# EAGLE board 8iPanelLED (EAGLE 6.6.0), part 1 of 2
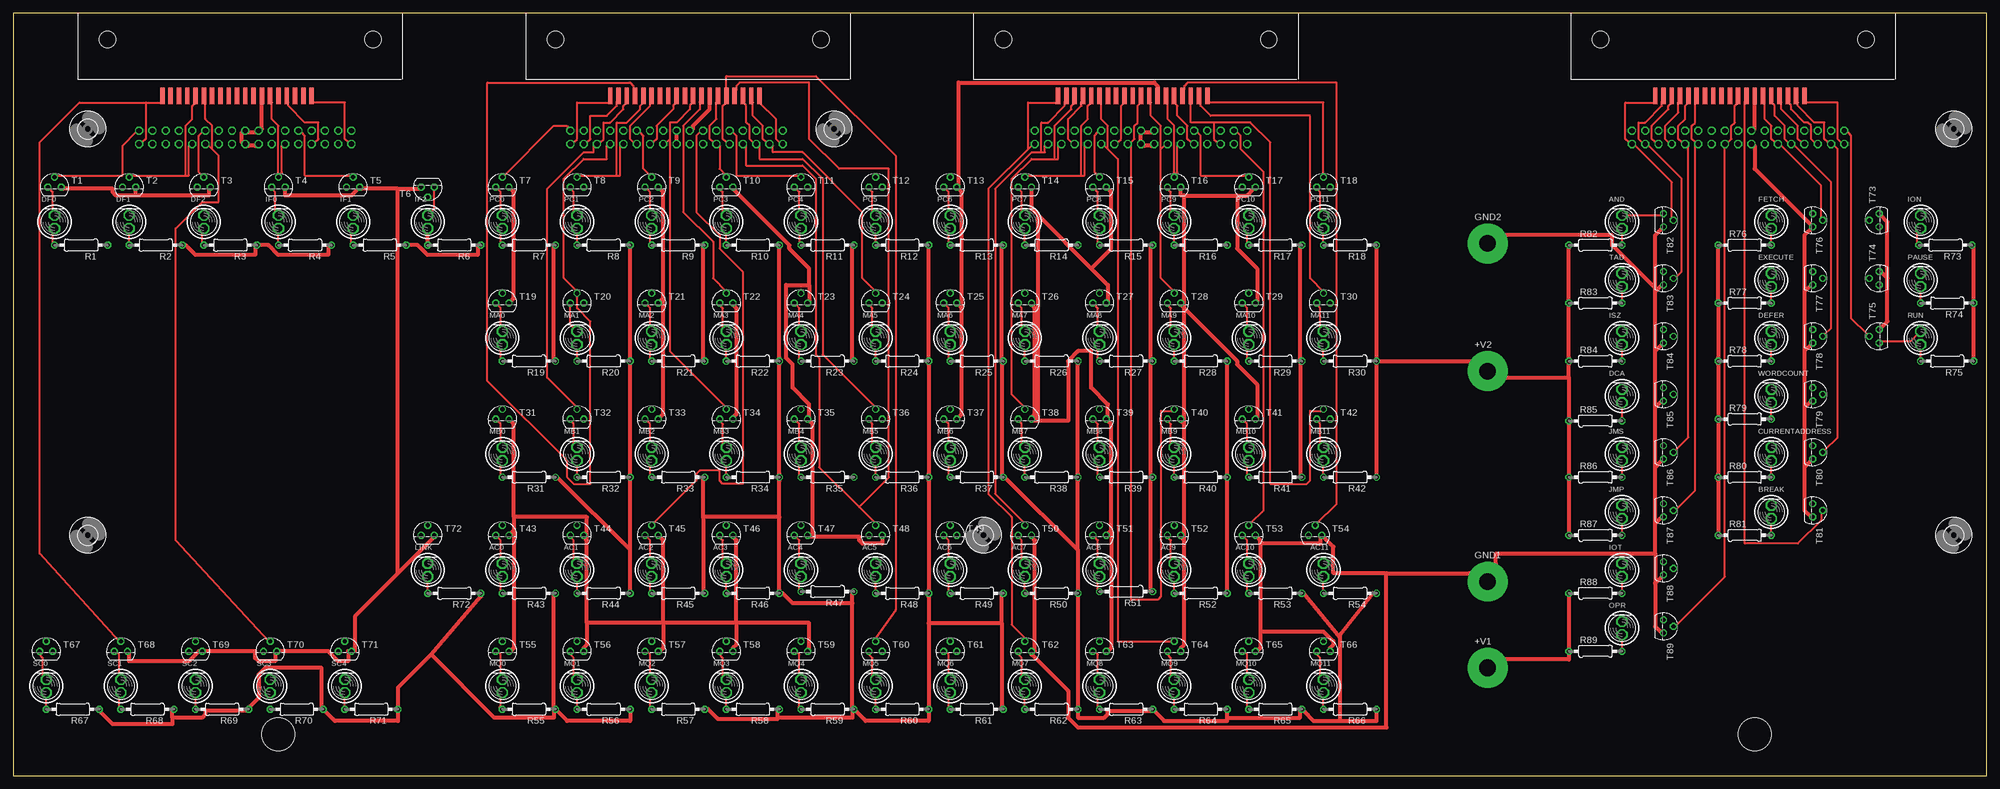
[diagram p2: board, top side]
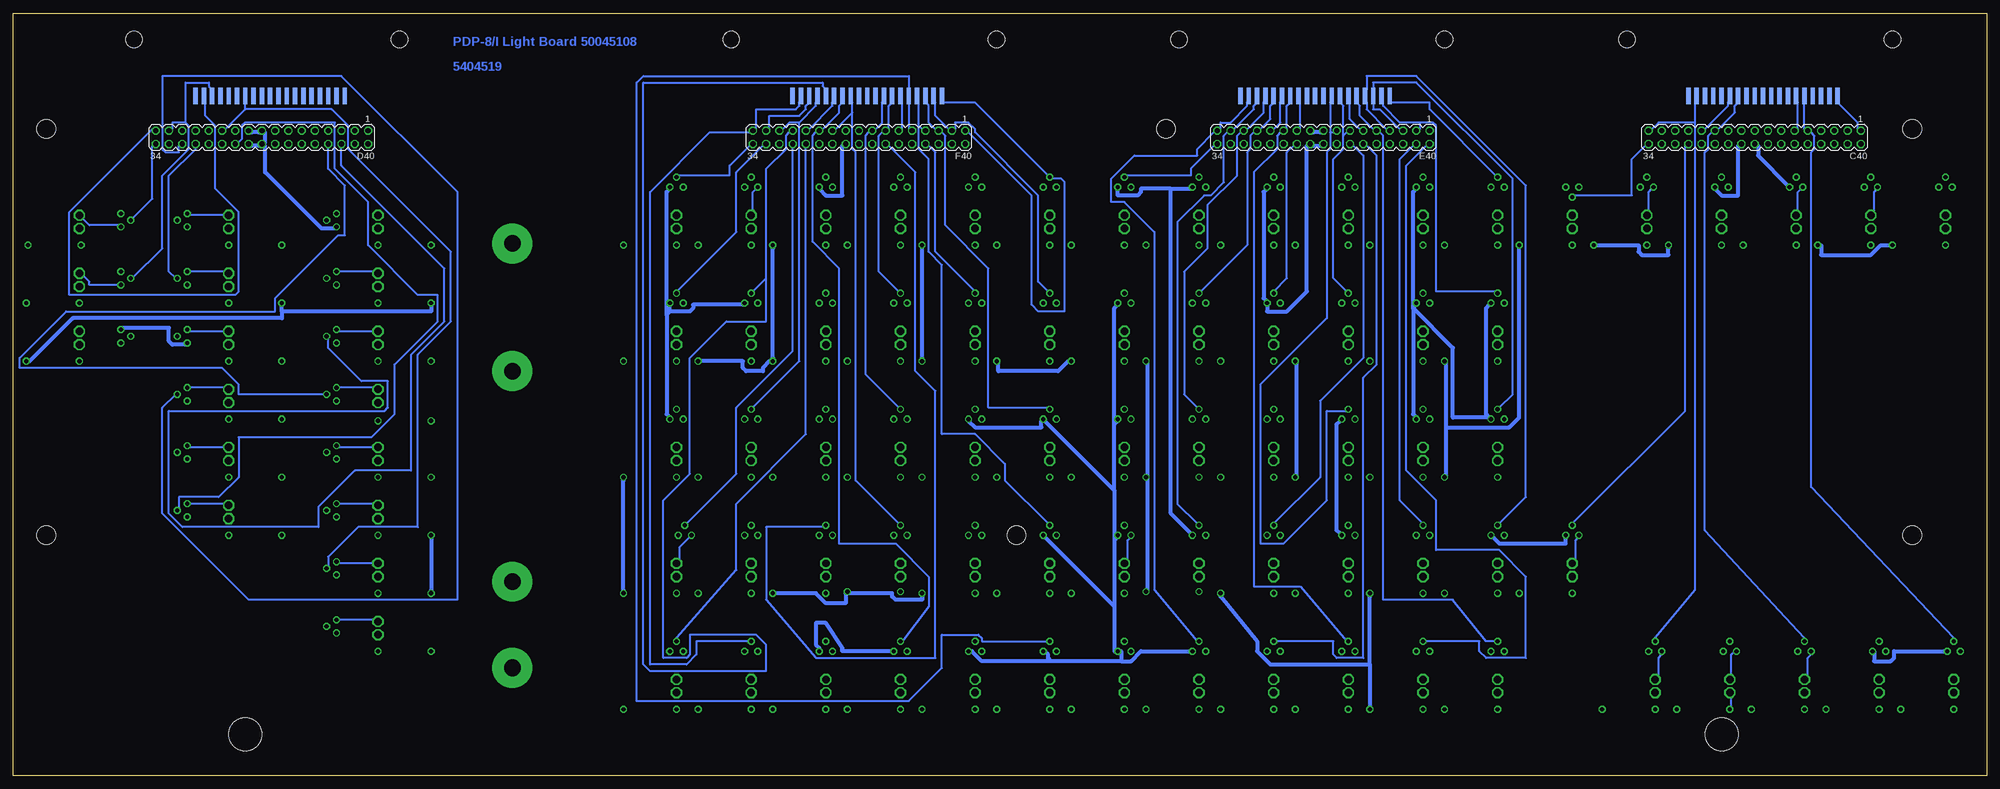
[diagram p3: board, bottom side, seen from below]

Size 377.82 x 146.05 mm. Coordinates in mm from the lower left corner, seen from the top.
Outline: 0,0 377.82,0 377.82,146.05 0,146.05 0,0
Copper layers (1*16): Top 0.035mm / dielectric 1.5mm / Bottom 0.035mm
Design rules "15mils": minimum track width 15mil, minimum drill 24mil, track to track 15mil, track to pad 10mil, pad to pad 10mil, via to via 10mil, smd to smd 10mil, copper to edge 25mil, drill to drill 10mil, minimum pad ring 10mil, minimum via ring 8mil, stop-mask expansion 0mil, vias tented up to drill 0mil, thermal gap 10mil
Net classes: 1 supply: width 0.762 mm
Holes 6.35 mm at 50.8,7.94 333.38,7.94

## Footprints (pad centres in the part's own frame; a part is rotated, then mirrored left to right if it is on the bottom)
SPADELUG = drill 3.175 pad 7.62 round: 1 0,0
BULB = drill 1.422 octagon: A 0,0; B 0,2.54
MA17-2 = drill 1.016 octagon: 1 -20.32,-1.27; 2 -20.32,1.27; 3 -17.78,-1.27; 4 -17.78,1.27; 5 -15.24,-1.27; 6 -15.24,1.27; 7 -12.7,-1.27; 8 -12.7,1.27; 9 -10.16,-1.27; 10 -10.16,1.27; 11 -7.62,-1.27; 12 -7.62,1.27; 13 -5.08,-1.27; 14 -5.08,1.27; 15 -2.54,-1.27; 16 -2.54,1.27; 17 0,-1.27; 18 0,1.27; 19 2.54,-1.27; 20 2.54,1.27; 21 5.08,-1.27; 22 5.08,1.27; 23 7.62,-1.27; 24 7.62,1.27; 25 10.16,-1.27; 26 10.16,1.27; 27 12.7,-1.27; 28 12.7,1.27; 29 15.24,-1.27; 30 15.24,1.27; 31 17.78,-1.27; 32 17.78,1.27; 33 20.32,-1.27; 34 20.32,1.27
FLEX19 = smd 3.175 x 0.838: 1 0,14.287; 2 0,12.7; 3 0,11.113; 4 0,9.525; 5 0,7.938; 6 0,6.35; 7 0,4.763; 8 0,3.175; 9 0,1.587; 10 0,0; 11 0,-1.587; 12 0,-3.175; 13 0,-4.763; 14 0,-6.35; 15 0,-7.938; 16 0,-9.525; 17 0,-11.113; 18 0,-12.7; 19 0,-14.287
0207/10 = drill 0.813 octagon: 1 -5.08,0; 2 5.08,0
TO92 = drill 0.813 octagon: 1 1.27,0; 2 0,1.905; 3 -1.27,0
STRAIN-RELIEF = hole 3.175: 7.62,56.515; 7.62,5.715
3,6 = hole 3.6: 0,0

## Placement (x,y rotation side)
+V1  LUG  [SPADELUG]  282.26,20.64 0 top
+V2  LUG  [SPADELUG]  282.26,77.47 0 top
AC0  [BULB]  93.66,38.1 0 top
AC1  [BULB]  107.95,38.1 0 top
AC2  [BULB]  122.24,38.1 0 top
AC3  [BULB]  136.53,38.1 0 top
AC4  [BULB]  150.81,38.1 0 top
AC5  [BULB]  165.1,38.1 0 top
AC6  [BULB]  179.39,38.1 0 top
AC7  [BULB]  193.68,38.1 0 top
AC8  [BULB]  207.96,38.1 0 top
AC9  [BULB]  222.25,38.1 0 top
AC10  [BULB]  236.54,38.1 0 top
AC11  [BULB]  250.82,38.1 0 top
AND  [BULB]  307.98,104.78 0 top
BREAK  [BULB]  336.55,49.21 0 top
C40  [MA17-2]  44.45,122.24 180 bottom
C40BOT  FLEX19  [FLEX19]  42.86,130.18 90 top
C40TOP  FLEX19  [FLEX19]  42.86,130.18 270 bottom
CURRENTADDRESS  [BULB]  336.55,60.33 0 top
D40  [MA17-2]  330.2,122.24 180 bottom
D40BOT  FLEX19  [FLEX19]  128.59,130.18 90 top
D40TOP  FLEX19  [FLEX19]  128.59,130.18 270 bottom
DCA  [BULB]  307.98,71.44 0 top
DEFER  [BULB]  336.55,82.55 0 top
DF0  [BULB]  7.94,104.78 0 top
DF1  [BULB]  22.23,104.78 0 top
DF2  [BULB]  36.51,104.78 0 top
E40  [MA17-2]  127,122.24 180 bottom
E40BOT  FLEX19  [FLEX19]  214.31,130.18 90 top
E40TOP  FLEX19  [FLEX19]  214.31,130.18 270 bottom
EXECUTE  [BULB]  336.55,93.66 0 top
F40  [MA17-2]  215.9,122.24 180 bottom
F40BOT  FLEX19  [FLEX19]  328.61,130.18 90 top
F40TOP  FLEX19  [FLEX19]  328.61,130.18 270 bottom
FETCH  [BULB]  336.55,104.78 0 top
GND1  LUG  [SPADELUG]  282.26,37.15 0 top
GND2  LUG  [SPADELUG]  282.26,101.92 0 top
IF0  [BULB]  50.8,104.78 0 top
IF1  [BULB]  65.09,104.78 0 top
IF2  [BULB]  79.38,104.78 0 top
ION  [BULB]  365.12,104.78 0 top
IOT  [BULB]  307.98,38.1 0 top
ISZ  [BULB]  307.98,82.55 0 top
JMP  [BULB]  307.98,49.21 0 top
JMS  [BULB]  307.98,60.33 0 top
LINK  [BULB]  79.38,38.1 0 top
MA0  [BULB]  93.66,82.55 0 top
MA1  [BULB]  107.95,82.55 0 top
MA2  [BULB]  122.24,82.55 0 top
MA3  [BULB]  136.53,82.55 0 top
MA4  [BULB]  150.81,82.55 0 top
MA5  [BULB]  165.1,82.55 0 top
MA6  [BULB]  179.39,82.55 0 top
MA7  [BULB]  193.68,82.55 0 top
MA8  [BULB]  207.96,82.55 0 top
MA9  [BULB]  222.25,82.55 0 top
MA10  [BULB]  236.54,82.55 0 top
MA11  [BULB]  250.82,82.55 0 top
MB0  [BULB]  93.66,60.33 0 top
MB1  [BULB]  107.95,60.33 0 top
MB2  [BULB]  122.24,60.33 0 top
MB3  [BULB]  136.53,60.33 0 top
MB4  [BULB]  150.81,60.33 0 top
MB5  [BULB]  165.1,60.33 0 top
MB6  [BULB]  179.39,60.33 0 top
MB7  [BULB]  193.68,60.33 0 top
MB8  [BULB]  207.96,60.33 0 top
MB9  [BULB]  222.25,60.33 0 top
MB10  [BULB]  236.54,60.33 0 top
MB11  [BULB]  250.82,60.33 0 top
MQ0  [BULB]  93.66,15.88 0 top
MQ1  [BULB]  107.95,15.88 0 top
MQ2  [BULB]  122.24,15.88 0 top
MQ3  [BULB]  136.53,15.88 0 top
MQ4  [BULB]  150.81,15.88 0 top
MQ5  [BULB]  165.1,15.88 0 top
MQ6  [BULB]  179.39,15.88 0 top
MQ7  [BULB]  193.68,15.88 0 top
MQ8  [BULB]  207.96,15.88 0 top
MQ9  [BULB]  222.25,15.88 0 top
MQ10  [BULB]  236.54,15.88 0 top
MQ11  [BULB]  250.82,15.88 0 top
OPR  [BULB]  307.98,26.99 0 top
PAUSE  [BULB]  365.12,93.66 0 top
PC0  [BULB]  93.66,104.78 0 top
PC1  [BULB]  107.95,104.78 0 top
PC2  [BULB]  122.24,104.78 0 top
PC3  [BULB]  136.53,104.78 0 top
PC4  [BULB]  150.81,104.78 0 top
PC5  [BULB]  165.1,104.78 0 top
PC6  [BULB]  179.39,104.78 0 top
PC7  [BULB]  193.68,104.78 0 top
PC8  [BULB]  207.96,104.78 0 top
PC9  [BULB]  222.25,104.78 0 top
PC10  [BULB]  236.54,104.78 0 top
PC11  [BULB]  250.82,104.78 0 top
R1  1.5K  [0207/10]  13.02,101.6 180 top
R2  1.5K  [0207/10]  27.3,101.6 180 top
R3  1.5K  [0207/10]  41.59,101.6 180 top
R4  1.5K  [0207/10]  55.88,101.6 180 top
R5  1.5K  [0207/10]  70.17,101.6 180 top
R6  1.5K  [0207/10]  84.45,101.6 180 top
R7  1.5K  [0207/10]  98.74,101.6 180 top
R8  1.5K  [0207/10]  113.03,101.6 180 top
R9  1.5K  [0207/10]  127.32,101.6 180 top
R10  1.5K  [0207/10]  141.6,101.6 180 top
R11  1.5K  [0207/10]  155.89,101.6 180 top
R12  1.5K  [0207/10]  170.18,101.6 180 top
R13  1.5K  [0207/10]  184.47,101.6 180 top
R14  1.5K  [0207/10]  198.75,101.6 180 top
R15  1.5K  [0207/10]  213.04,101.6 180 top
R16  1.5K  [0207/10]  227.33,101.6 180 top
R17  1.5K  [0207/10]  241.62,101.6 180 top
R18  1.5K  [0207/10]  255.91,101.6 180 top
R19  1.5K  [0207/10]  98.74,79.38 180 top
R20  1.5K  [0207/10]  113.03,79.38 180 top
R21  1.5K  [0207/10]  127.32,79.38 180 top
R22  1.5K  [0207/10]  141.6,79.38 180 top
R23  1.5K  [0207/10]  155.89,79.38 180 top
R24  1.5K  [0207/10]  170.18,79.38 180 top
R25  1.5K  [0207/10]  184.47,79.38 180 top
R26  1.5K  [0207/10]  198.75,79.38 180 top
R27  1.5K  [0207/10]  213.04,79.38 180 top
R28  1.5K  [0207/10]  227.33,79.38 180 top
R29  1.5K  [0207/10]  241.62,79.38 180 top
R30  1.5K  [0207/10]  255.91,79.38 180 top
R31  1.5K  [0207/10]  98.74,57.15 180 top
R32  1.5K  [0207/10]  113.03,57.15 180 top
R33  1.5K  [0207/10]  127.32,57.15 180 top
R34  1.5K  [0207/10]  141.6,57.15 180 top
R35  1.5K  [0207/10]  155.89,57.15 180 top
R36  1.5K  [0207/10]  170.18,57.15 180 top
R37  1.5K  [0207/10]  184.47,57.15 180 top
R38  1.5K  [0207/10]  198.75,57.15 180 top
R39  1.5K  [0207/10]  213.04,57.15 180 top
R40  1.5K  [0207/10]  227.33,57.15 180 top
R41  1.5K  [0207/10]  241.62,57.15 180 top
R42  1.5K  [0207/10]  255.91,57.15 180 top
R43  1.5K  [0207/10]  98.74,34.92 180 top
R44  1.5K  [0207/10]  113.03,34.92 180 top
R45  1.5K  [0207/10]  127.32,34.92 180 top
R46  1.5K  [0207/10]  141.6,34.92 180 top
R47  1.5K  [0207/10]  155.89,35.24 180 top
R48  1.5K  [0207/10]  170.18,34.92 180 top
R49  1.5K  [0207/10]  184.47,34.92 180 top
R50  1.5K  [0207/10]  198.75,34.92 180 top
R51  1.5K  [0207/10]  213.04,35.24 180 top
R52  1.5K  [0207/10]  227.33,34.92 180 top
R53  1.5K  [0207/10]  241.62,34.92 180 top
R54  1.5K  [0207/10]  255.91,34.92 180 top
R55  1.5K  [0207/10]  98.74,12.7 180 top
R56  1.5K  [0207/10]  113.03,12.7 180 top
R57  1.5K  [0207/10]  127.32,12.7 180 top
R58  1.5K  [0207/10]  141.6,12.7 180 top
R59  1.5K  [0207/10]  155.89,12.7 180 top
R60  1.5K  [0207/10]  170.18,12.7 180 top
R61  1.5K  [0207/10]  184.47,12.7 180 top
R62  1.5K  [0207/10]  198.75,12.7 180 top
R63  1.5K  [0207/10]  213.04,12.7 180 top
R64  1.5K  [0207/10]  227.33,12.7 180 top
R65  1.5K  [0207/10]  241.62,12.7 180 top
R66  1.5K  [0207/10]  255.91,12.7 180 top
R67  1.5K  [0207/10]  11.43,12.7 180 top
R68  1.5K  [0207/10]  25.72,12.7 180 top
R69  1.5K  [0207/10]  40.01,12.7 180 top
R70  1.5K  [0207/10]  54.29,12.7 180 top
R71  1.5K  [0207/10]  68.58,12.7 180 top
R72  1.5K  [0207/10]  84.45,34.92 180 top
R73  1.5K  [0207/10]  369.89,101.6 180 top
R74  1.5K  [0207/10]  370.2,90.49 180 top
R75  1.5K  [0207/10]  370.2,79.38 180 top
R76  1.5K  [0207/10]  331.47,101.6 0 top
R77  1.5K  [0207/10]  331.47,90.49 0 top
R78  1.5K  [0207/10]  331.47,79.38 0 top
R79  1.5K  [0207/10]  331.47,68.26 0 top
R80  1.5K  [0207/10]  331.47,57.15 0 top
R81  1.5K  [0207/10]  331.47,46.04 0 top
R82  1.5K  [0207/10]  302.89,101.6 0 top
R83  1.5K  [0207/10]  302.89,90.49 0 top
R84  1.5K  [0207/10]  302.89,79.38 0 top
R85  1.5K  [0207/10]  302.89,67.94 0 top
R86  1.5K  [0207/10]  302.89,57.15 0 top
R87  1.5K  [0207/10]  302.89,46.04 0 top
R88  1.5K  [0207/10]  302.89,34.92 0 top
R89  1.5K  [0207/10]  302.89,23.81 0 top
RUN  [BULB]  365.12,82.55 0 top
SC0  [BULB]  6.35,15.88 0 top
SC1  [BULB]  20.64,15.88 0 top
SC2  [BULB]  34.92,15.88 0 top
SC3  [BULB]  49.21,15.88 0 top
SC4  [BULB]  63.5,15.88 0 top
T1  2N2222  [TO92]  7.94,112.71 0 top
T2  2N2222  [TO92]  22.23,112.71 0 top
T3  2N2222  [TO92]  36.51,112.71 0 top
T4  2N2222  [TO92]  50.8,112.71 0 top
T5  2N2222  [TO92]  65.09,112.71 0 top
T6  2N2222  [TO92]  79.38,112.71 180 top
T7  2N2222  [TO92]  93.66,112.71 0 top
T8  2N2222  [TO92]  107.95,112.71 0 top
T9  2N2222  [TO92]  122.24,112.71 0 top
T10  2N2222  [TO92]  136.53,112.71 0 top
T11  2N2222  [TO92]  150.81,112.71 0 top
T12  2N2222  [TO92]  165.1,112.71 0 top
T13  2N2222  [TO92]  179.39,112.71 0 top
T14  2N2222  [TO92]  193.68,112.71 0 top
T15  2N2222  [TO92]  207.96,112.71 0 top
T16  2N2222  [TO92]  222.25,112.71 0 top
T17  2N2222  [TO92]  236.54,112.71 0 top
T18  2N2222  [TO92]  250.82,112.71 0 top
T19  2N2222  [TO92]  93.66,90.49 0 top
T20  2N2222  [TO92]  107.95,90.49 0 top
T21  2N2222  [TO92]  122.24,90.49 0 top
T22  2N2222  [TO92]  136.53,90.49 0 top
T23  2N2222  [TO92]  150.81,90.49 0 top
T24  2N2222  [TO92]  165.1,90.49 0 top
T25  2N2222  [TO92]  179.39,90.49 0 top
T26  2N2222  [TO92]  193.68,90.49 0 top
T27  2N2222  [TO92]  207.96,90.49 0 top
T28  2N2222  [TO92]  222.25,90.49 0 top
T29  2N2222  [TO92]  236.54,90.49 0 top
T30  2N2222  [TO92]  250.82,90.49 0 top
T31  2N2222  [TO92]  93.66,68.26 0 top
T32  2N2222  [TO92]  107.95,68.26 0 top
T33  2N2222  [TO92]  122.24,68.26 0 top
T34  2N2222  [TO92]  136.53,68.26 0 top
T35  2N2222  [TO92]  150.81,68.26 0 top
T36  2N2222  [TO92]  165.1,68.26 0 top
T37  2N2222  [TO92]  179.39,68.26 0 top
T38  2N2222  [TO92]  193.68,68.26 0 top
T39  2N2222  [TO92]  207.96,68.26 0 top
T40  2N2222  [TO92]  222.25,68.26 0 top
T41  2N2222  [TO92]  236.54,68.26 0 top
T42  2N2222  [TO92]  250.82,68.26 0 top
T43  2N2222  [TO92]  93.66,46.04 0 top
T44  2N2222  [TO92]  107.95,46.04 0 top
T45  2N2222  [TO92]  122.24,46.04 0 top
T46  2N2222  [TO92]  136.53,46.04 0 top
T47  2N2222  [TO92]  150.81,46.04 0 top
T48  2N2222  [TO92]  165.1,46.04 0 top
T49  2N2222  [TO92]  179.39,46.04 0 top
T50  2N2222  [TO92]  193.68,46.04 0 top
T51  2N2222  [TO92]  207.96,46.04 0 top
T52  2N2222  [TO92]  222.25,46.04 0 top
T53  2N2222  [TO92]  236.54,46.04 0 top
T54  2N2222  [TO92]  249.24,46.04 0 top
T55  2N2222  [TO92]  93.66,23.81 0 top
T56  2N2222  [TO92]  107.95,23.81 0 top
T57  2N2222  [TO92]  122.24,23.81 0 top
T58  2N2222  [TO92]  136.53,23.81 0 top
T59  2N2222  [TO92]  150.81,23.81 0 top
T60  2N2222  [TO92]  165.1,23.81 0 top
T61  2N2222  [TO92]  179.39,23.81 0 top
T62  2N2222  [TO92]  193.68,23.81 0 top
T63  2N2222  [TO92]  207.96,23.81 0 top
T64  2N2222  [TO92]  222.25,23.81 0 top
T65  2N2222  [TO92]  236.54,23.81 0 top
T66  2N2222  [TO92]  250.82,23.81 0 top
T67  2N2222  [TO92]  6.35,23.81 0 top
T68  2N2222  [TO92]  20.64,23.81 0 top
T69  2N2222  [TO92]  34.92,23.81 0 top
T70  2N2222  [TO92]  49.21,23.81 0 top
T71  2N2222  [TO92]  63.5,23.81 0 top
T72  2N2222  [TO92]  79.38,46.04 0 top
T73  2N2222  [TO92]  357.19,106.36 90 top
T74  2N2222  [TO92]  357.19,95.25 90 top
T75  2N2222  [TO92]  357.19,84.14 90 top
T76  2N2222  [TO92]  344.49,106.36 270 top
T77  2N2222  [TO92]  344.49,95.25 270 top
T78  2N2222  [TO92]  344.49,84.14 270 top
T79  2N2222  [TO92]  344.49,73.03 270 top
T80  2N2222  [TO92]  344.49,61.91 270 top
T81  2N2222  [TO92]  344.49,50.8 270 top
T82  2N2222  [TO92]  315.91,106.36 270 top
T83  2N2222  [TO92]  315.91,95.25 270 top
T84  2N2222  [TO92]  315.91,84.14 270 top
T85  2N2222  [TO92]  315.91,73.03 270 top
T86  2N2222  [TO92]  315.91,61.91 270 top
T87  2N2222  [TO92]  315.91,50.8 270 top
T88  2N2222  [TO92]  315.91,39.69 270 top
T89  2N2222  [TO92]  315.91,28.57 270 top
TAD  [BULB]  307.98,93.66 0 top
U$1  [STRAIN-RELIEF]  74.61,133.35 90 top
U$2  [STRAIN-RELIEF]  160.34,133.35 90 top
U$3  [STRAIN-RELIEF]  246.06,133.35 90 top
U$4  [STRAIN-RELIEF]  360.36,133.35 90 top
U$5  [3,6]  371.48,123.83 0 top
U$6  [3,6]  371.48,46.04 0 top
U$7  [3,6]  185.74,46.04 0 top
U$8  [3,6]  14.29,46.04 0 top
U$9  [3,6]  14.29,123.83 0 top
U$11  [3,6]  157.16,123.83 0 top
WORDCOUNT  [BULB]  336.55,71.44 0 top